# EAGLE schematic Base Station v3b (EAGLE 9.4.2)

## Sheet 1 of 4
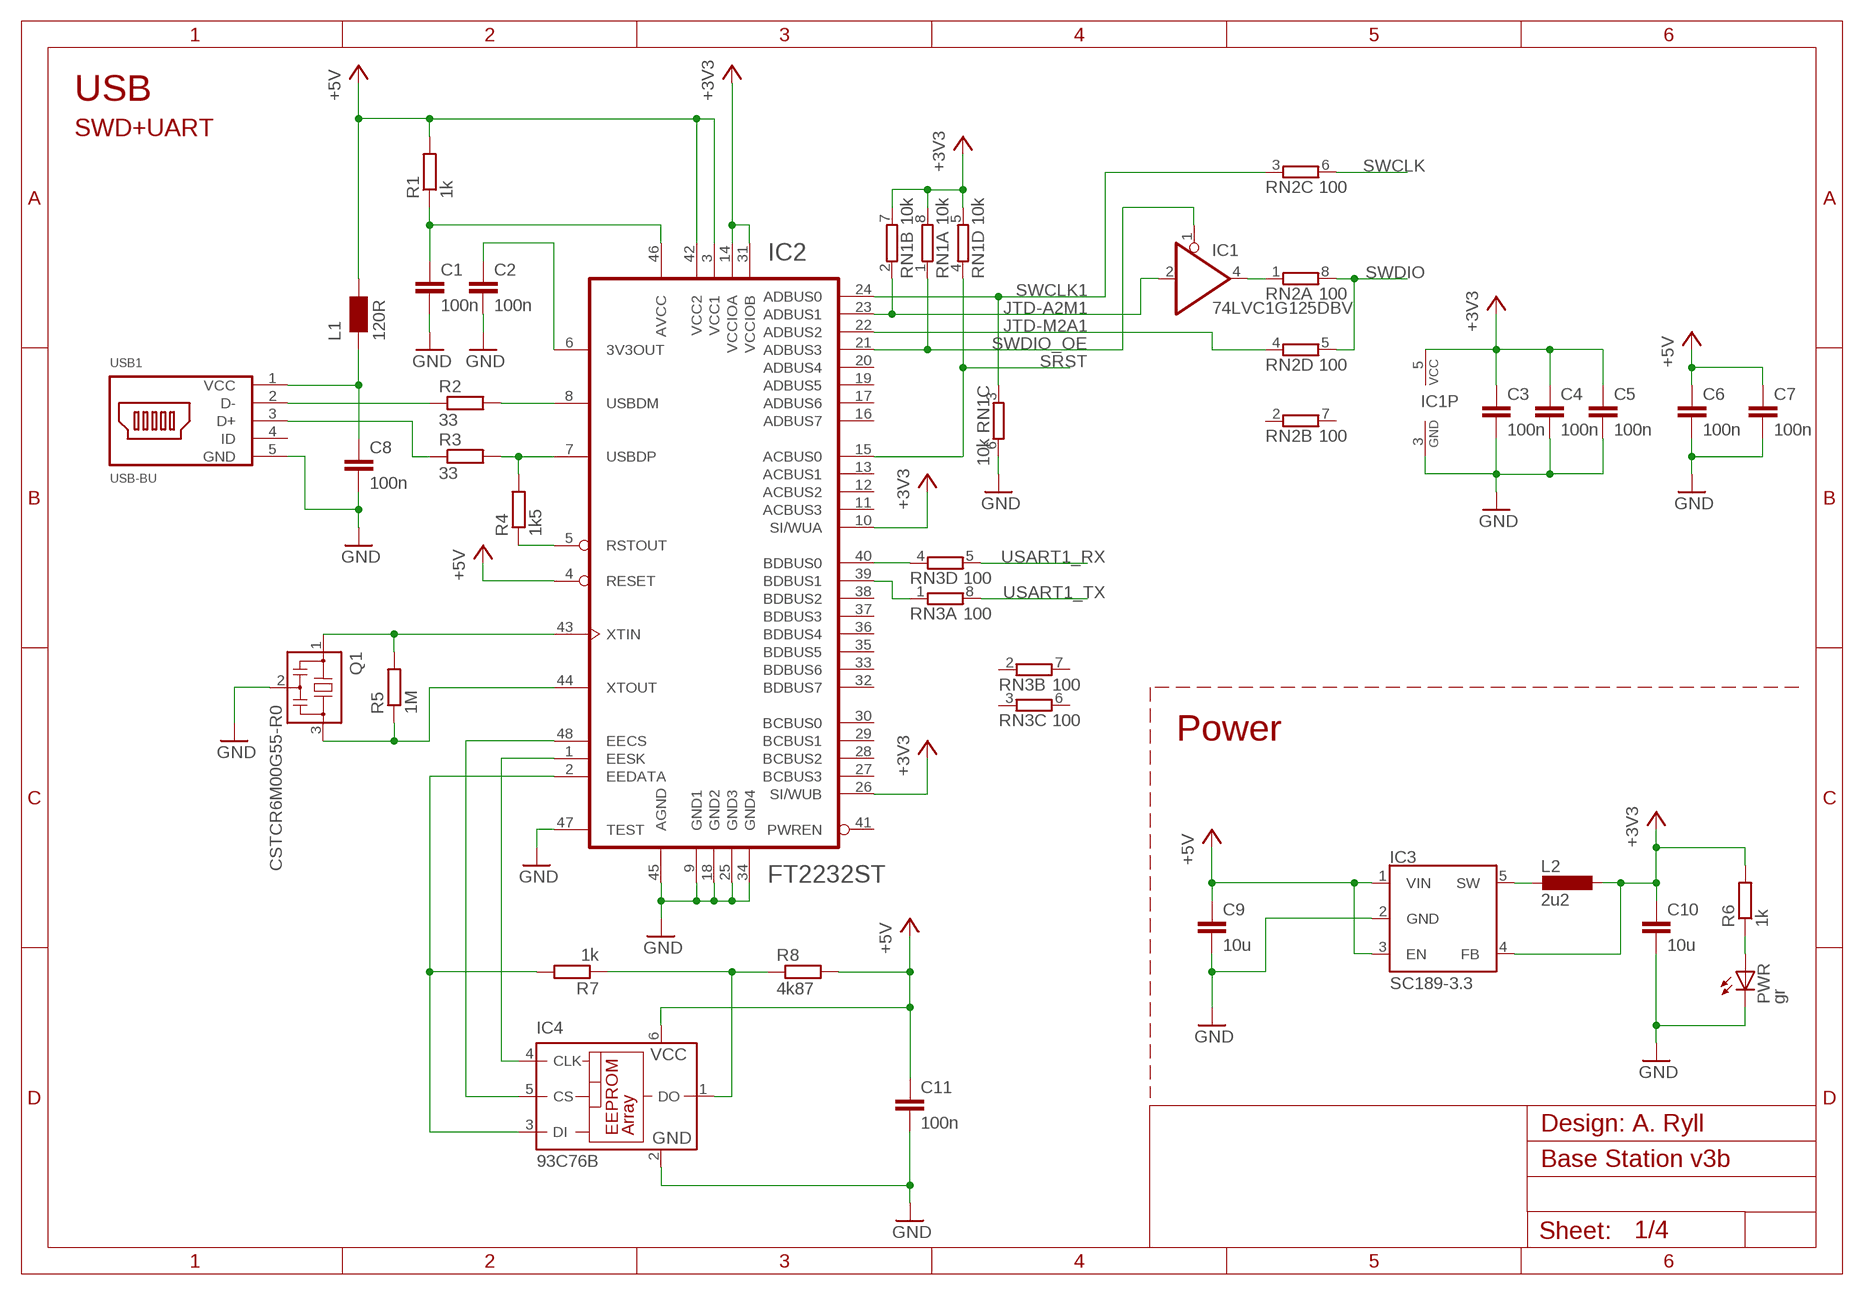
[diagram p0: schematic, sheet 1]

### Parts
C1  100n  C-EUC0603  [C0603]
C2  100n  C-EUC0603  [C0603]
C3  100n  C-EUC0603  [C0603]
C4  100n  C-EUC0603  [C0603]
C5  100n  C-EUC0603  [C0603]
C6  100n  C-EUC0603  [C0603]
C7  100n  C-EUC0603  [C0603]
C8  100n  C-EUC0603  [C0603]
C9  10u  C-EUC0603  [C0603]
C10  10u  C-EUC0603  [C0603]
C11  100n  C-EUC0603  [C0603]
IC1  74LVC1G125DBV  [SOT23-5]
IC2  FT2232ST  [LQFP48-ST]
IC3  SC189-3.3  LM3671  [SOT23-5]
IC4  93C76B  [SOT23-6]
L1  120R  WE-CBF_0603  [0603]
L2  2u2  LIHLP  [IHLP1616]
PWR  gr  LEDCHIP-LED0603  [CHIP-LED0603]
Q1  CSTCR6M00G55-R0  CSTCR6M00G53Z  [CSTCR6M]
R1  1k  R-EU_R0603  [R0603]
R2  33  R-EU_R0603  [R0603]
R3  33  R-EU_R0603  [R0603]
R4  1k5  R-EU_R0603  [R0603]
R5  1M  R-EU_R0603  [R0603]
R6  1k  R-EU_R0603  [R0603]
R7  1k  R-EU_R0603  [R0603]
R8  4k87  R-EU_R0603  [R0603]
RN1  10k  4R-NEXB28V  [EXB28V]
RN2  100  4R-NEXB28V  [EXB28V]
RN3  100  4R-NEXB28V  [EXB28V]
USB1  USB-BU  [USB-BMICRO]

### Nets
+3V3: C3.1 C4.1 C5.1 C10.1 IC1.5(VCC) IC2.10(SI/WUA) IC2.14(VCCIOA) IC2.26(SI/WUB) IC2.31(VCCIOB) IC3.4(FB) L2.P$1 R6.2 RN1.5 RN1.7 RN1.8 ; also sheet 2,3
+5V: C6.1 C7.1 C9.1 C11.1 IC2.3(VCC1) IC2.4(RESET) IC2.42(VCC2) IC3.1(VIN) IC3.3(EN) IC4.6(VCC) L1.2 R1.2 R8.2 ; also sheet 4
GND: C1.2 C2.2 C3.2 C4.2 C5.2 C6.2 C7.2 C8.2 C9.2 C10.2 C11.2 IC1.3(GND) IC2.9(GND1) IC2.18(GND2) IC2.25(GND3) IC2.34(GND4) IC2.45(AGND) IC2.47(TEST) IC3.2(GND) IC4.2(GND) PWR.C Q1.2 RN1.6 USB1.5(GND) ; also sheet 2,3,4
JTD-A2M1: IC1.2(I) IC2.23(ADBUS1) RN1.2
JTD-M2A1: IC2.22(ADBUS2) RN2.4
N$9: IC2.48(EECS) IC4.5(CS)
N$10: IC2.1(EESK) IC4.4(CLK)
N$14: IC2.2(EEDATA) IC4.3(DI) R7.2
N$28: IC2.44(XTOUT) Q1.3 R5.1
N$29: IC4.1(DO) R7.1 R8.1
N$48: PWR.A R6.1
N$56: IC1.4(O) RN2.1
N$71: IC2.40(BDBUS0) RN3.4
N$72: IC2.39(BDBUS1) RN3.1
N$103: IC2.7(USBDP) R3.2 R4.2
N$104: IC2.8(USBDM) R2.2
N$105: IC2.5(RSTOUT) R4.1
N$106: C2.1 IC2.6(3V3OUT)
N$108: C8.1 L1.1 USB1.1(VCC)
N$109: R2.1 USB1.2(D-)
N$110: R3.1 USB1.3(D+)
N$111: C1.1 IC2.46(AVCC) R1.1
N$112: IC2.43(XTIN) Q1.1 R5.2
SRST: IC2.15(ACBUS0) RN1.4 ; also sheet 2
SW-OUT: IC3.5(SW) L2.P$2
SWCLK: RN2.6 ; also sheet 2
SWCLK1: IC2.24(ADBUS0) RN1.3 RN2.3
SWDIO: RN2.5 RN2.8 ; also sheet 2
SWDIO_OE: IC1.1(OE) IC2.21(ADBUS3) RN1.1
USART1_RX: RN3.5 ; also sheet 2
USART1_TX: RN3.8 ; also sheet 2
Unconnected: IC2.11(ACBUS3) IC2.12(ACBUS2) IC2.13(ACBUS1) IC2.16(ADBUS7) IC2.17(ADBUS6) IC2.19(ADBUS5) IC2.20(ADBUS4) IC2.27(BCBUS3) IC2.28(BCBUS2) IC2.29(BCBUS1) IC2.30(BCBUS0) IC2.32(BDBUS7) IC2.33(BDBUS6) IC2.35(BDBUS5) IC2.36(BDBUS4) IC2.37(BDBUS3) IC2.38(BDBUS2) IC2.41(PWREN) RN2.2 RN2.7 RN3.2 RN3.3 RN3.6 RN3.7 USB1.4(ID)

### Notes on the sheet
- USB
- SWD+UART
- Power
- Design: A. Ryll

## Sheet 2 of 4
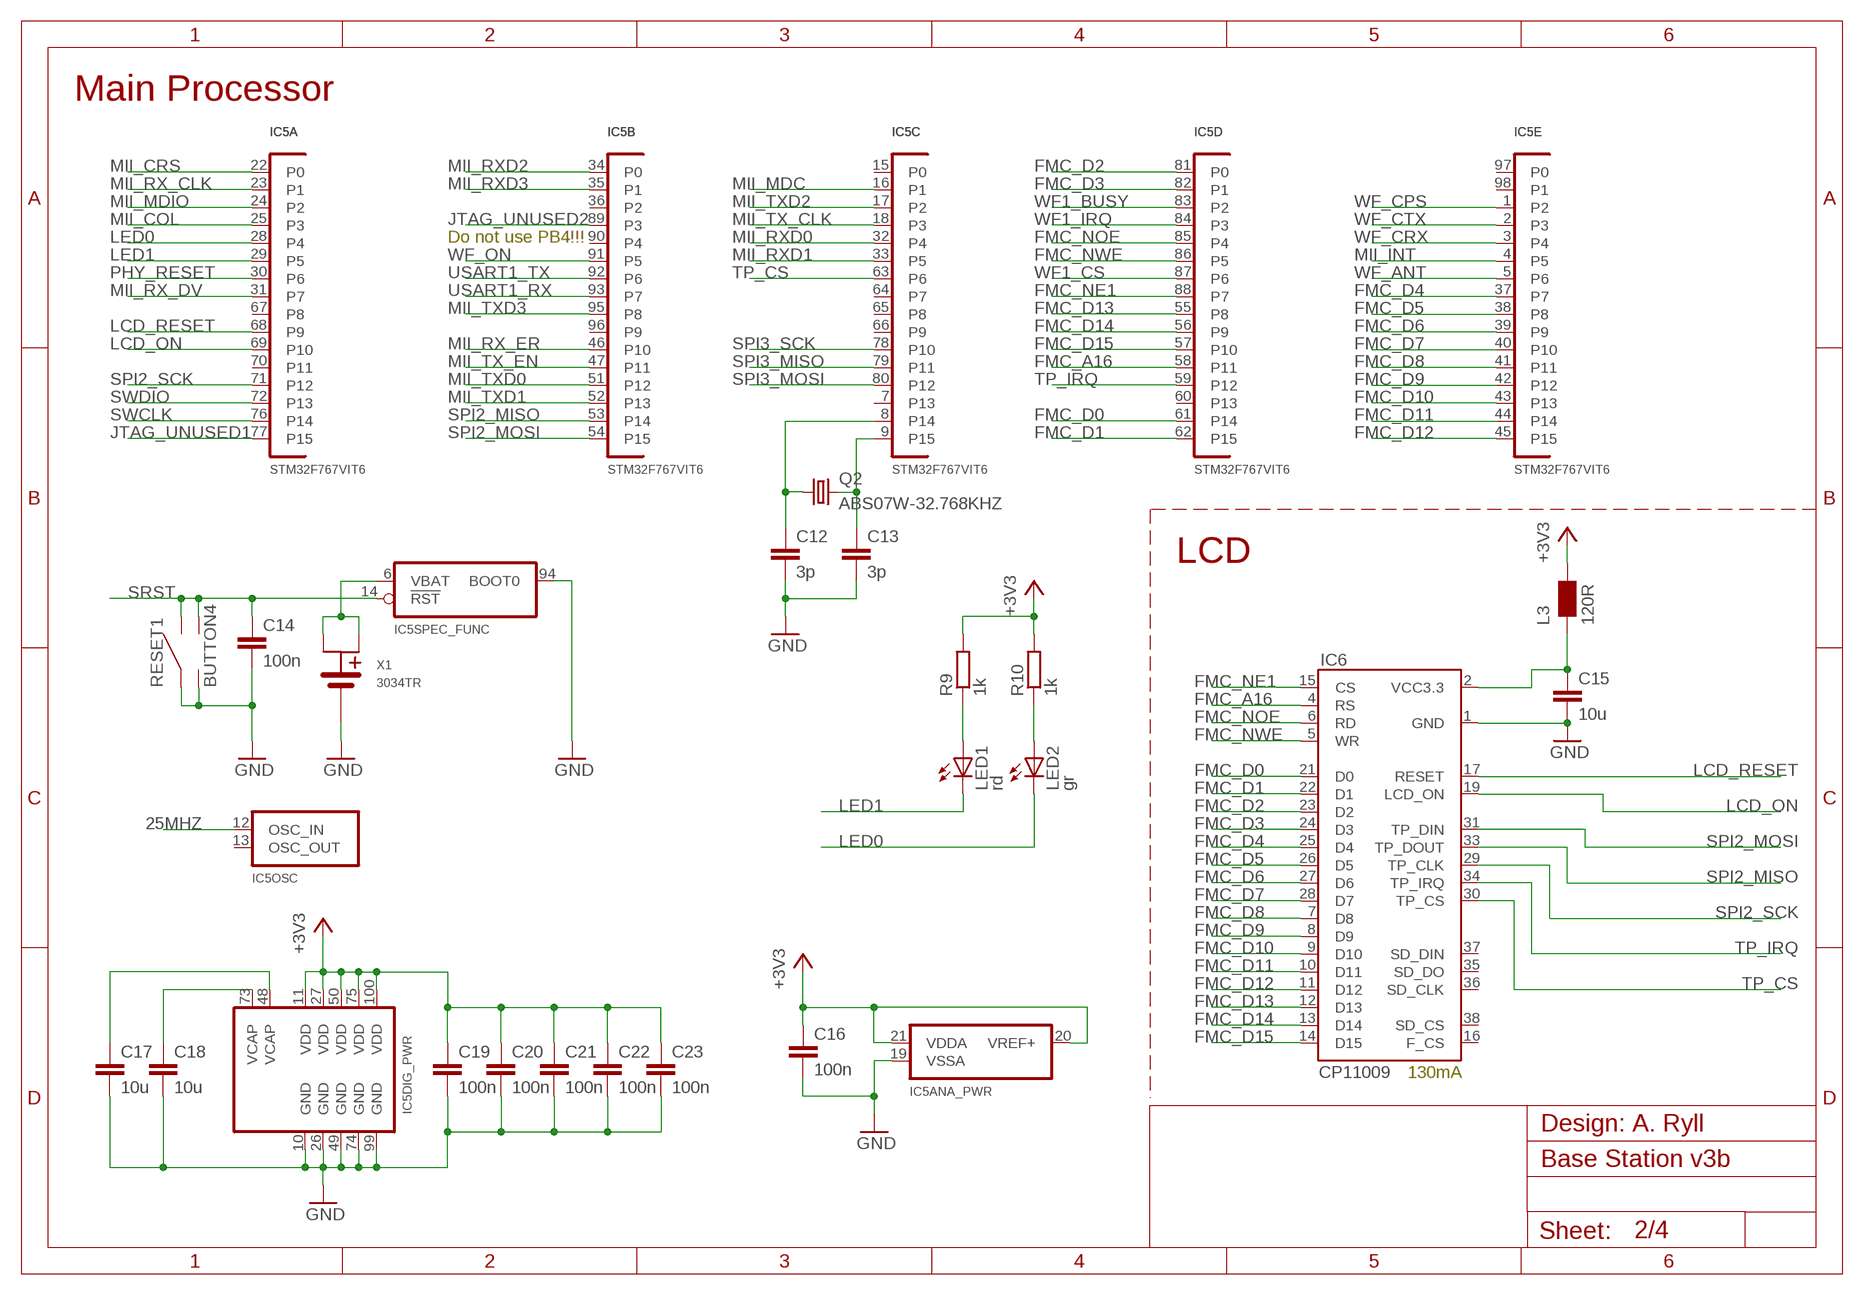
[diagram p1: schematic, sheet 2]

### Parts
C12  3p  C-EUC0603  [C0603]
C13  3p  C-EUC0603  [C0603]
C14  100n  C-EUC0603  [C0603]
C15  10u  C-EUC0603  [C0603]
C16  100n  C-EUC0603  [C0603]
C17  10u  C-EUC0603  [C0603]
C18  10u  C-EUC0603  [C0603]
C19  100n  C-EUC0603  [C0603]
C20  100n  C-EUC0603  [C0603]
C21  100n  C-EUC0603  [C0603]
C22  100n  C-EUC0603  [C0603]
C23  100n  C-EUC0603  [C0603]
IC5  STM32F767VIT6  STM32F76_V  [LQFP100-ST]
IC6  CP11009  CP11009X  [CP11009-THX]
L3  120R  WE-CBF_0603  [0603]
LED1  rd  LEDCHIP-LED0603  [CHIP-LED0603]
LED2  gr  LEDCHIP-LED0603  [CHIP-LED0603]
Q2  ABS07W-32.768KHZ  CRYSTAL07W  [CRYSTAL-07W]
R9  1k  R-EU_R0603  [R0603]
R10  1k  R-EU_R0603  [R0603]
RESET1  BUTTON4  [BUTTON4]
X1  3034TR  BAT3  [CR2025]

### Nets
25MHZ: IC5.12(OSC:OSC_IN) ; also sheet 3
+3V3: C16.1 C19.1 C20.1 C21.1 C22.1 C23.1 IC5.11(DIG_PWR:VDD) IC5.20(ANA_PWR:VREF+) IC5.21(ANA_PWR:VDDA) IC5.27(DIG_PWR:VDD) IC5.50(DIG_PWR:VDD) IC5.75(DIG_PWR:VDD) IC5.100(DIG_PWR:VDD) L3.2 R9.2 R10.2 ; also sheet 1,3
FMC_A16: IC5.58(D:P11) IC6.4(RS)
FMC_D0: IC5.61(D:P14) IC6.21(D0)
FMC_D1: IC5.62(D:P15) IC6.22(D1)
FMC_D2: IC5.81(D:P0) IC6.23(D2)
FMC_D3: IC5.82(D:P1) IC6.24(D3)
FMC_D4: IC5.37(E:P7) IC6.25(D4)
FMC_D5: IC5.38(E:P8) IC6.26(D5)
FMC_D6: IC5.39(E:P9) IC6.27(D6)
FMC_D7: IC5.40(E:P10) IC6.28(D7)
FMC_D8: IC5.41(E:P11) IC6.7(D8)
FMC_D9: IC5.42(E:P12) IC6.8(D9)
FMC_D10: IC5.43(E:P13) IC6.9(D10)
FMC_D11: IC5.44(E:P14) IC6.10(D11)
FMC_D12: IC5.45(E:P15) IC6.11(D12)
FMC_D13: IC5.55(D:P8) IC6.12(D13)
FMC_D14: IC5.56(D:P9) IC6.13(D14)
FMC_D15: IC5.57(D:P10) IC6.14(D15)
FMC_NE1: IC5.88(D:P7) IC6.15(CS)
FMC_NOE: IC5.85(D:P4) IC6.6(RD)
FMC_NWE: IC5.86(D:P5) IC6.5(WR)
GND: C12.2 C13.2 C14.2 C15.2 C16.2 C17.2 C18.2 C19.2 C20.2 C21.2 C22.2 C23.2 IC5.10(DIG_PWR:GND) IC5.19(ANA_PWR:VSSA) IC5.26(DIG_PWR:GND) IC5.49(DIG_PWR:GND) IC5.74(DIG_PWR:GND) IC5.94(SPEC_FUNC:BOOT0) IC5.99(DIG_PWR:GND) IC6.1(GND) RESET1.1 RESET1.2 X1.GND ; also sheet 1,3,4
JTAG_UNUSED1: IC5.77(A:P15)
JTAG_UNUSED2: IC5.89(B:P3)
LCD_ON: IC5.69(A:P10) IC6.19(LCD_ON)
LCD_RESET: IC5.68(A:P9) IC6.17(RESET)
LED0: IC5.28(A:P4) LED2.C
LED1: IC5.29(A:P5) LED1.C
MII_COL: IC5.25(A:P3) ; also sheet 3
MII_CRS: IC5.22(A:P0) ; also sheet 3
MII_INT: IC5.4(E:P5) ; also sheet 3
MII_MDC: IC5.16(C:P1) ; also sheet 3
MII_MDIO: IC5.24(A:P2) ; also sheet 3
MII_RX_CLK: IC5.23(A:P1) ; also sheet 3
MII_RX_DV: IC5.31(A:P7) ; also sheet 3
MII_RX_ER: IC5.46(B:P10) ; also sheet 3
MII_RXD0: IC5.32(C:P4) ; also sheet 3
MII_RXD1: IC5.33(C:P5) ; also sheet 3
MII_RXD2: IC5.34(B:P0) ; also sheet 3
MII_RXD3: IC5.35(B:P1) ; also sheet 3
MII_TX_CLK: IC5.18(C:P3) ; also sheet 3
MII_TX_EN: IC5.47(B:P11) ; also sheet 3
MII_TXD0: IC5.51(B:P12) ; also sheet 3
MII_TXD1: IC5.52(B:P13) ; also sheet 3
MII_TXD2: IC5.17(C:P2) ; also sheet 3
MII_TXD3: IC5.95(B:P8) ; also sheet 3
N$6: C18.1 IC5.73(DIG_PWR:VCAP)
N$31: C17.1 IC5.48(DIG_PWR:VCAP)
N$67: LED2.A R10.1
N$68: LED1.A R9.1
N$73: C15.1 IC6.2(VCC3.3) L3.1
OSC32_IN: C12.1 IC5.8(C:P14) Q2.1
OSC32_OUT: C13.1 IC5.9(C:P15) Q2.2
PHY_RESET: IC5.30(A:P6) ; also sheet 3
SPI2_MISO: IC5.53(B:P14) IC6.33(TP_DOUT)
SPI2_MOSI: IC5.54(B:P15) IC6.31(TP_DIN)
SPI2_SCK: IC5.71(A:P12) IC6.29(TP_CLK)
SPI3_MISO: IC5.79(C:P11) ; also sheet 4
SPI3_MOSI: IC5.80(C:P12) ; also sheet 4
SPI3_SCK: IC5.78(C:P10) ; also sheet 4
SRST: C14.1 IC5.14(SPEC_FUNC:!RST) RESET1.3 RESET1.4 ; also sheet 1
SWCLK: IC5.76(A:P14) ; also sheet 1
SWDIO: IC5.72(A:P13) ; also sheet 1
TP_CS: IC5.63(C:P6) IC6.30(TP_CS)
TP_IRQ: IC5.59(D:P12) IC6.34(TP_IRQ)
USART1_RX: IC5.93(B:P7) ; also sheet 1
USART1_TX: IC5.92(B:P6) ; also sheet 1
VBAT: IC5.6(SPEC_FUNC:VBAT) X1.POS1 X1.POS2
WF1_BUSY: IC5.83(D:P2) ; also sheet 4
WF1_CS: IC5.87(D:P6) ; also sheet 4
WF1_IRQ: IC5.84(D:P3) ; also sheet 4
WF_ANT: IC5.5(E:P6) ; also sheet 4
WF_CPS: IC5.1(E:P2) ; also sheet 4
WF_CRX: IC5.3(E:P4) ; also sheet 4
WF_CTX: IC5.2(E:P3) ; also sheet 4
WF_ON: IC5.91(B:P5) ; also sheet 4
Unconnected: IC5.7(C:P13) IC5.13(OSC:OSC_OUT) IC5.15(C:P0) IC5.36(B:P2) IC5.60(D:P13) IC5.64(C:P7) IC5.65(C:P8) IC5.66(C:P9) IC5.67(A:P8) IC5.70(A:P11) IC5.90(B:P4) IC5.96(B:P9) IC5.97(E:P0) IC5.98(E:P1) IC6.16(F_CS) IC6.35(SD_DO) IC6.36(SD_CLK) IC6.37(SD_DIN) IC6.38(SD_CS)

### Notes on the sheet
- Main Processor
- Do not use PB4!!!
- LCD
- 130mA
- Design: A. Ryll

## Sheet 3 of 4
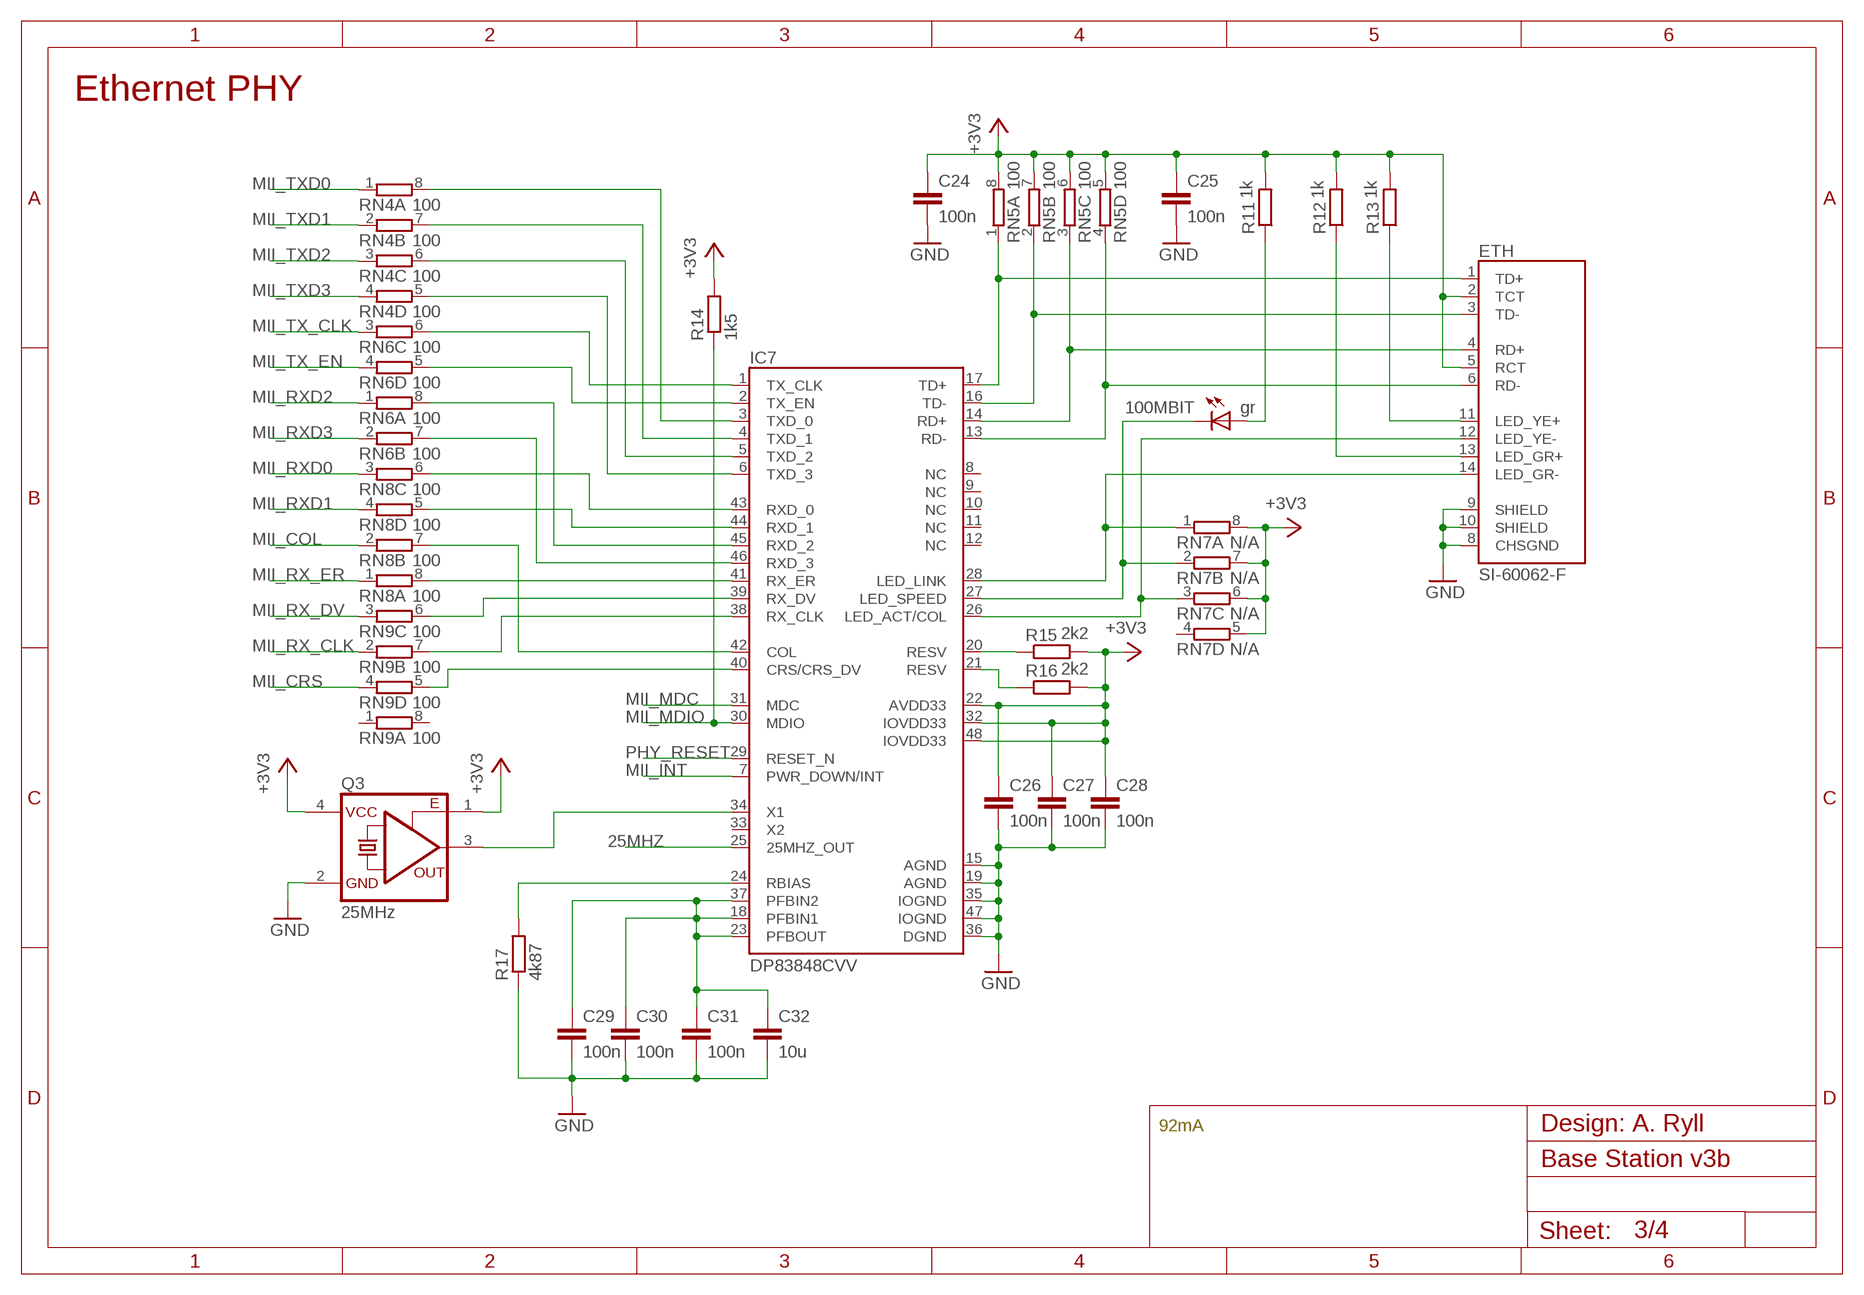
[diagram p2: schematic, sheet 3]

### Parts
100MBIT  gr  LEDCHIP-LED0603  [CHIP-LED0603]
C24  100n  C-EUC0603  [C0603]
C25  100n  C-EUC0603  [C0603]
C26  100n  C-EUC0603  [C0603]
C27  100n  C-EUC0603  [C0603]
C28  100n  C-EUC0603  [C0603]
C29  100n  C-EUC0603  [C0603]
C30  100n  C-EUC0603  [C0603]
C31  100n  C-EUC0603  [C0603]
C32  10u  C-EUC0603  [C0603]
ETH  SI-60062-F  RJ45-LED  [RJ45-LED]
IC7  DP83848CVV  DB8348C  [LQFP48]
Q3  25MHz  OSCI7X  [7X]
R11  1k  R-EU_R0603  [R0603]
R12  1k  R-EU_R0603  [R0603]
R13  1k  R-EU_R0603  [R0603]
R14  1k5  R-EU_R0603  [R0603]
R15  2k2  R-EU_R0603  [R0603]
R16  2k2  R-EU_R0603  [R0603]
R17  4k87  R-EU_R0603  [R0603]
RN4  100  4R-NEXB28V  [EXB28V]
RN5  100  4R-NEXB28V  [EXB28V]
RN6  100  4R-NEXB28V  [EXB28V]
RN7  N/A  4R-NEXB28V  [EXB28V]
RN8  100  4R-NEXB28V  [EXB28V]
RN9  100  4R-NEXB28V  [EXB28V]

### Nets
25MHZ: IC7.25(25MHZ_OUT) ; also sheet 2
+3V3: C24.1 C25.1 C26.1 C27.1 C28.1 ETH.2(TCT) ETH.5(RCT) IC7.22(AVDD33) IC7.32(IOVDD33) IC7.48(IOVDD33) Q3.1(OE) Q3.4(VCC) R11.2 R12.2 R13.2 R14.2 R15.2 R16.2 RN5.5 RN5.6 RN5.7 RN5.8 RN7.5 RN7.6 RN7.7 RN7.8 ; also sheet 1,2
GND: C24.2 C25.2 C26.2 C27.2 C28.2 C29.2 C30.2 C31.2 C32.2 ETH.8(CHSGND) ETH.9(SHIELD) ETH.10(SHIELD) IC7.15(AGND) IC7.19(AGND) IC7.35(IOGND) IC7.36(DGND) IC7.47(IOGND) Q3.2(GND) R17.1 ; also sheet 1,2,4
MII_COL: RN8.2 ; also sheet 2
MII_CRS: RN9.4 ; also sheet 2
MII_INT: IC7.7(PWR_DOWN/INT) ; also sheet 2
MII_MDC: IC7.31(MDC) ; also sheet 2
MII_MDIO: IC7.30(MDIO) R14.1 ; also sheet 2
MII_RX_CLK: RN9.2 ; also sheet 2
MII_RX_DV: RN9.3 ; also sheet 2
MII_RX_ER: RN8.1 ; also sheet 2
MII_RXD0: RN8.3 ; also sheet 2
MII_RXD1: RN8.4 ; also sheet 2
MII_RXD2: RN6.1 ; also sheet 2
MII_RXD3: RN6.2 ; also sheet 2
MII_TX_CLK: RN6.3 ; also sheet 2
MII_TX_EN: RN6.4 ; also sheet 2
MII_TXD0: RN4.1 ; also sheet 2
MII_TXD1: RN4.2 ; also sheet 2
MII_TXD2: RN4.3 ; also sheet 2
MII_TXD3: RN4.4 ; also sheet 2
N$11: IC7.3(TXD_0) RN4.8
N$12: IC7.4(TXD_1) RN4.7
N$13: IC7.5(TXD_2) RN4.6
N$15: IC7.6(TXD_3) RN4.5
N$16: IC7.1(TX_CLK) RN6.6
N$17: IC7.2(TX_EN) RN6.5
N$18: IC7.45(RXD_2) RN6.8
N$30: IC7.46(RXD_3) RN6.7
N$32: IC7.43(RXD_0) RN8.6
N$33: IC7.44(RXD_1) RN8.5
N$34: IC7.42(COL) RN8.7
N$35: IC7.41(RX_ER) RN8.8
N$36: IC7.39(RX_DV) RN9.6
N$37: IC7.38(RX_CLK) RN9.7
N$38: IC7.40(CRS/CRS_DV) RN9.5
N$39: IC7.24(RBIAS) R17.2
N$40: C29.1 C30.1 C31.1 C32.1 IC7.18(PFBIN1) IC7.23(PFBOUT) IC7.37(PFBIN2)
N$41: IC7.20(RESV) R15.1
N$42: IC7.21(RESV) R16.1
N$43: ETH.12(LED_YE-) IC7.26(LED_ACT/COL) RN7.3
N$44: 100MBIT.C IC7.27(LED_SPEED) RN7.2
N$46: ETH.14(LED_GR-) IC7.28(LED_LINK) RN7.1
N$47: ETH.6(RD-) IC7.13(RD-) RN5.4
N$49: ETH.4(RD+) IC7.14(RD+) RN5.3
N$50: ETH.3(TD-) IC7.16(TD-) RN5.2
N$51: ETH.1(TD+) IC7.17(TD+) RN5.1
N$52: 100MBIT.A R11.1
N$53: ETH.13(LED_GR+) R12.1
N$54: ETH.11(LED_YE+) R13.1
N$55: IC7.34(X1) Q3.3(FO)
PHY_RESET: IC7.29(RESET_N) ; also sheet 2
Unconnected: IC7.8(NC) IC7.9(NC) IC7.10(NC) IC7.11(NC) IC7.12(NC) IC7.33(X2) RN7.4 RN9.1 RN9.8

### Notes on the sheet
- Ethernet PHY
- 92mA | Design: A. Ryll

## Sheet 4 of 4
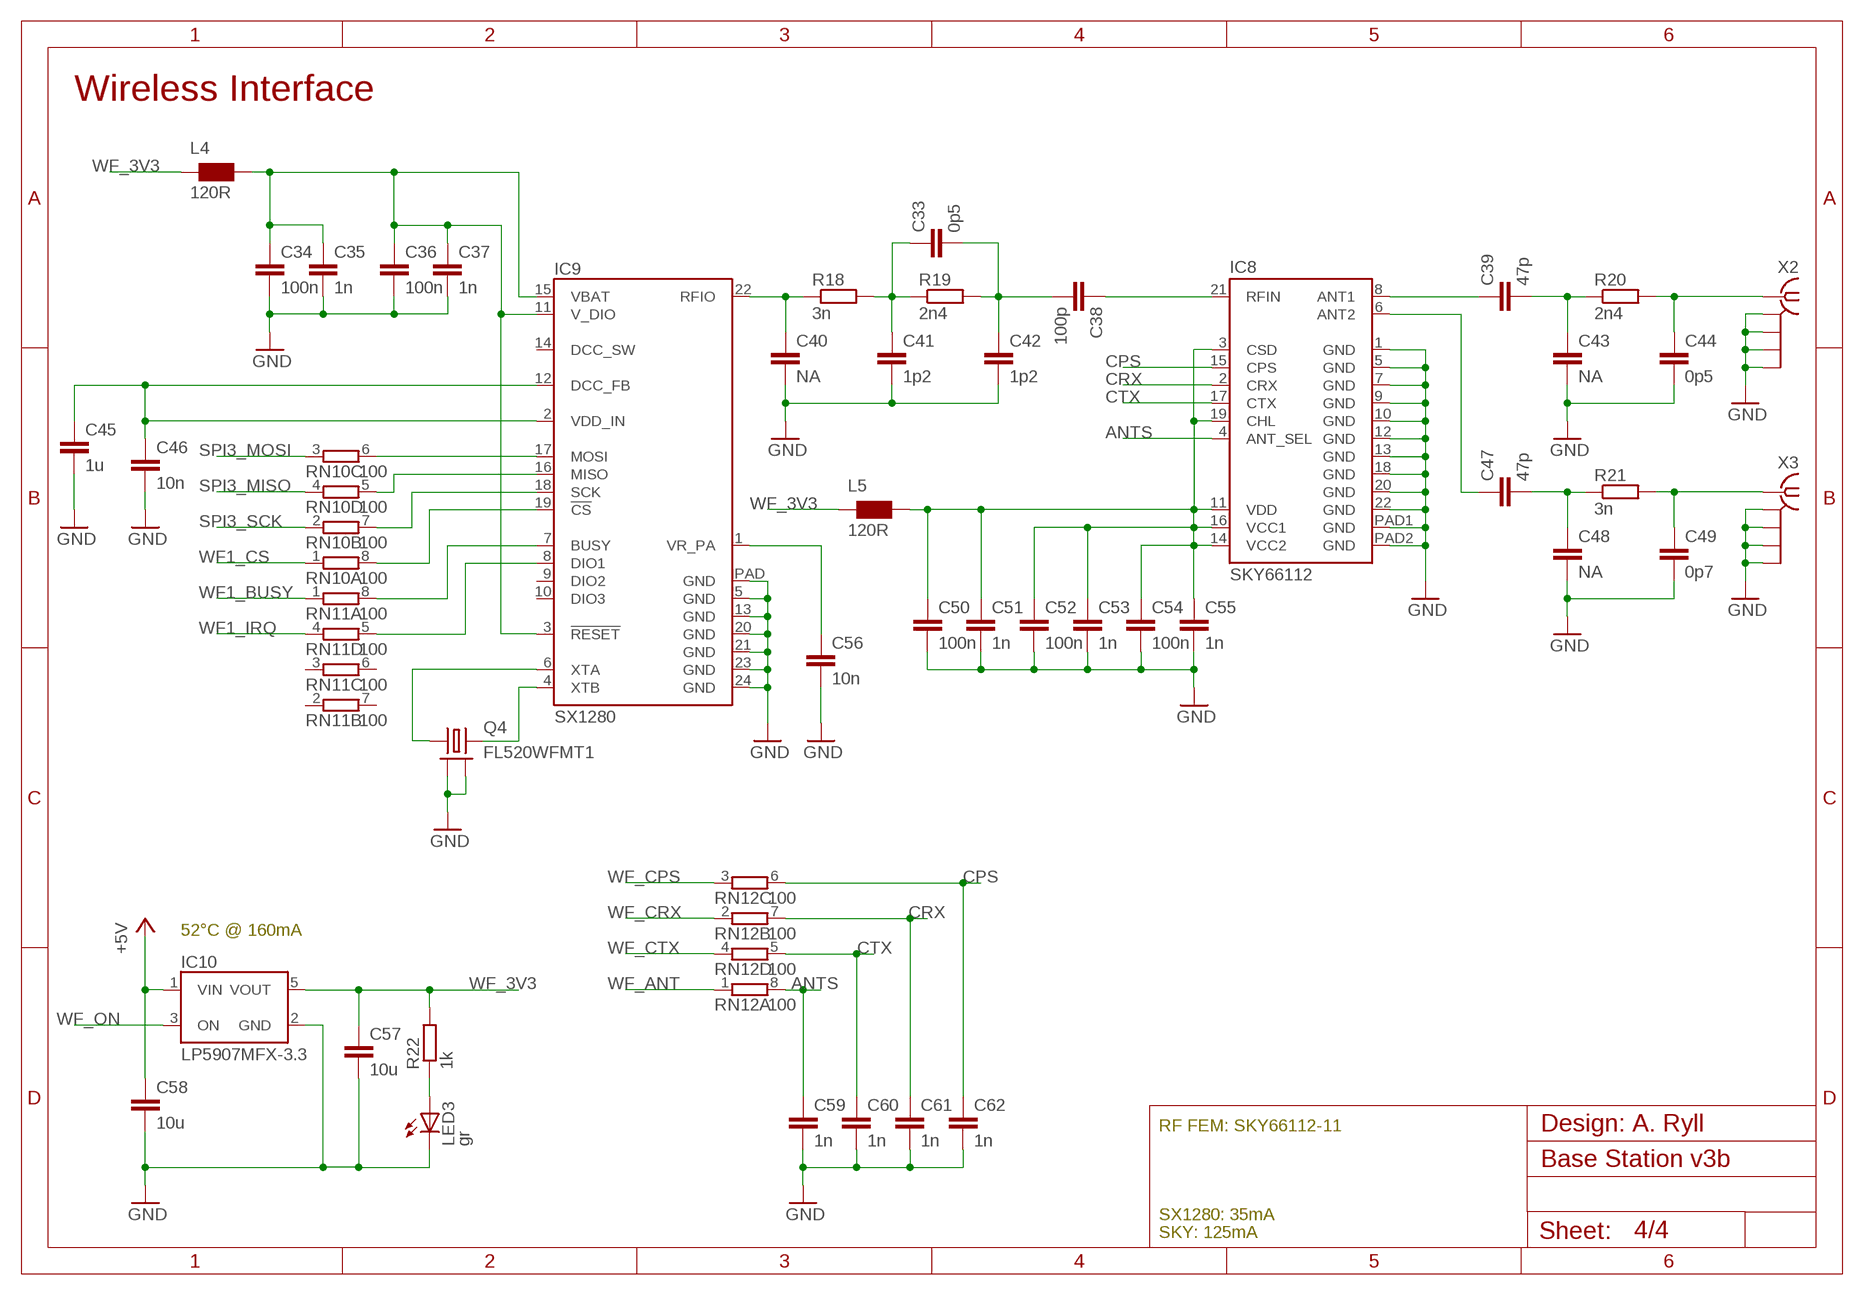
[diagram p3: schematic, sheet 4]

### Parts
C33  0p5  C-EUC0402  [C0402]
C34  100n  C-EUC0603  [C0603]
C35  1n  C-EUC0603  [C0603]
C36  100n  C-EUC0603  [C0603]
C37  1n  C-EUC0603  [C0603]
C38  100p  C-EUC0402  [C0402]
C39  47p  C-EUC0402  [C0402]
C40  NA  C-EUC0402  [C0402]
C41  1p2  C-EUC0402  [C0402]
C42  1p2  C-EUC0402  [C0402]
C43  NA  C-EUC0402  [C0402]
C44  0p5  C-EUC0402  [C0402]
C45  1u  C-EUC0603  [C0603]
C46  10n  C-EUC0603  [C0603]
C47  47p  C-EUC0402  [C0402]
C48  NA  C-EUC0402  [C0402]
C49  0p7  C-EUC0402  [C0402]
C50  100n  C-EUC0603  [C0603]
C51  1n  C-EUC0603  [C0603]
C52  100n  C-EUC0603  [C0603]
C53  1n  C-EUC0603  [C0603]
C54  100n  C-EUC0603  [C0603]
C55  1n  C-EUC0603  [C0603]
C56  10n  C-EUC0603  [C0603]
C57  10u  C-EUC0603  [C0603]
C58  10u  C-EUC0603  [C0603]
C59  1n  C-EUC0603  [C0603]
C60  1n  C-EUC0603  [C0603]
C61  1n  C-EUC0603  [C0603]
C62  1n  C-EUC0603  [C0603]
IC8  SKY66112  [SMCM-22]
IC9  SX1280  [QFN24L]
IC10  LP5907MFX-3.3  LP2980  [SOT23-5L]
L4  120R  WE-CBF_0603  [0603]
L5  120R  WE-CBF_0603  [0603]
LED3  gr  LEDCHIP-LED0603  [CHIP-LED0603]
Q4  FL520WFMT1  CRYSTAL47M  [CRYSTAL-7M]
R18  3n  R-EU_R0402  [R0402]
R19  2n4  R-EU_R0402  [R0402]
R20  2n4  R-EU_R0402  [R0402]
R21  3n  R-EU_R0402  [R0402]
R22  1k  R-EU_R0603  [R0603]
RN10  100  4R-NEXB28V  [EXB28V]
RN11  100  4R-NEXB28V  [EXB28V]
RN12  100  4R-NEXB28V  [EXB28V]
X2  ANT-SMA-EDGERA  [ANT-SMA-RA]
X3  ANT-SMA-EDGERA  [ANT-SMA-RA]

### Nets
+5V: C58.1 IC10.1(VIN) ; also sheet 1
ANTS: C59.1 IC8.4(ANT_SEL) RN12.8
CPS: C62.1 IC8.15(CPS) RN12.6
CRX: C61.1 IC8.2(CRX) RN12.7
CTX: C60.1 IC8.17(CTX) RN12.5
GND: C34.2 C35.2 C36.2 C37.2 C40.2 C41.2 C42.2 C43.2 C44.2 C45.2 C46.2 C48.2 C49.2 C50.2 C51.2 C52.2 C53.2 C54.2 C55.2 C56.2 C57.2 C58.2 C59.2 C60.2 C61.2 C62.2 IC8.1(GND) IC8.5(GND) IC8.7(GND) IC8.9(GND) IC8.10(GND) IC8.12(GND) IC8.13(GND) IC8.18(GND) IC8.20(GND) IC8.22(GND) IC8.PAD1(GND) IC8.PAD2(GND) IC9.5(GND) IC9.13(GND) IC9.20(GND) IC9.21(GND) IC9.23(GND) IC9.24(GND) IC9.PAD(GND) IC10.2(GND) LED3.C Q4.2(GND1) Q4.4(GND2) X2.GND1(GND) X2.GND2(GND1) X2.GND3(GND2) X2.GND4(GND3) X3.GND1(GND) X3.GND2(GND1) X3.GND3(GND2) X3.GND4(GND3) ; also sheet 1,2,3
N$1: IC9.17(MOSI) RN10.6
N$2: IC9.16(MISO) RN10.5
N$3: IC9.18(SCK) RN10.7
N$4: IC9.19(!CS) RN10.8
N$5: IC9.7(BUSY) RN11.8
N$7: IC9.8(DIO1) RN11.5
N$20: LED3.A R22.1
N$74: IC9.6(XTA) Q4.1
N$75: IC9.4(XTB) Q4.3
N$76: C33.1 C41.1 R18.2 R19.1
N$77: C33.2 C38.2 C42.1 R19.2
N$78: C56.1 IC9.1(VR_PA)
N$79: C45.1 C46.1 IC9.2(VDD_IN) IC9.12(DCC_FB)
N$80: C38.1 IC8.21(RFIN)
N$82 [50Ohm]: C39.2 C43.1 R20.1
N$83 [50Ohm]: C44.1 R20.2 X2.C
N$84 [50Ohm]: C47.2 C48.1 R21.1
N$85 [50Ohm]: C49.1 R21.2 X3.C
N$86 [50Ohm]: C39.1 IC8.8(ANT1)
N$87 [50Ohm]: C47.1 IC8.6(ANT2)
RFIO1: C40.1 IC9.22(RFIO) R18.1
SPI3_MISO: RN10.4 ; also sheet 2
SPI3_MOSI: RN10.3 ; also sheet 2
SPI3_SCK: RN10.2 ; also sheet 2
WF1_BUSY: RN11.1 ; also sheet 2
WF1_CS: RN10.1 ; also sheet 2
WF1_IRQ: RN11.4 ; also sheet 2
WF_3V3: C57.1 IC10.5(VOUT) L4.1 L5.1 R22.2
WF_3V3FEM: C50.1 C51.1 C52.1 C53.1 C54.1 C55.1 IC8.3(CSD) IC8.11(VDD) IC8.14(VCC2) IC8.16(VCC1) IC8.19(CHL) L5.2
WF_3V3SX: C34.1 C35.1 C36.1 C37.1 IC9.3(!RESET) IC9.11(V_DIO) IC9.15(VBAT) L4.2
WF_ANT: RN12.1 ; also sheet 2
WF_CPS: RN12.3 ; also sheet 2
WF_CRX: RN12.2 ; also sheet 2
WF_CTX: RN12.4 ; also sheet 2
WF_ON: IC10.3(ON) ; also sheet 2
Unconnected: IC9.9(DIO2) IC9.10(DIO3) IC9.14(DCC_SW) RN11.2 RN11.3 RN11.6 RN11.7

### Notes on the sheet
- Wireless Interface
- 52°C @ 160mA
- RF FEM: SKY66112-11 | Design: A. Ryll
- SX1280: 35mA
- SKY: 125mA

## Library data of the parts
100MBIT LED1-LED3 PWR = led:LED: LED OSRAM: - CHIPLED LG R971, LG N971, LY N971, LG Q971, LY Q971, LO R971, LY R971 LH N974, LH R974 LS Q976, LO Q976, LY Q976 LO Q996 - Hyper CHIPLED LW Q18S LB Q993, LB Q99A, LB R99A - SideLED LS A670, LO A670, LY A670, LG A670, LP A670 LB A673, LV A673, LT A673, LW A673 LH A674 LY A675 LS A676, LA A676, LO A676, LY A676, LW A676 LS A679, LY A679, LG A679 - Hyper Micro SIDELED® LS Y876, LA Y876, LO Y876, LY Y876 LT Y87S - SmartLED LW L88C, LW L88S LB L89C, LB L89S, LG L890 LS L89K, LO L89K, LY L89K LS L896, LA L896, LO L896, LY L896 - TOPLED LS T670, LO T670, LY T670, LG T670, LP T670 LSG T670, LSP T670, LSY T670, LOP T670, LYG T670 LG T671, LOG T671, LSG T671 LB T673, LV T673, LT T673, LW T673 LH T674 LS T676, LA T676, LO T676, LY T676, LB T676, LH T676, LSB T676, LW T676 LB T67C, LV T67C, LT T67C, LS T67K, LO T67K, LY T67K, LW E67C LS E67B, LA E67B, LO E67B, LY E67B, LB E67C, LV E67C, LT E67C LW T67C LS T679, LY T679, LG T679 LS T770, LO T770, LY T770, LG T770, LP T770 LB T773, LV T773, LT T773, LW T773 LH T774 LS E675, LA E675, LY E675, LS T675 LS T776, LA T776, LO T776, LY T776, LB T776 LHGB T686 LT T68C, LB T68C - Hyper Mini TOPLED® LB M676 - Mini TOPLED Santana® LG M470 LS M47K, LO M47K, LY M47K Source: http://www.osram.convergy.de LUXEON: - LUMILED® LXK2-PW12-R00, LXK2-PW12-S00, LXK2-PW14-U00, LXK2-PW14-V00 LXK2-PM12-R00, LXK2-PM12-S00, LXK2-PM14-U00 LXK2-PE12-Q00, LXK2-PE12-R00, LXK2-PE12-S00, LXK2-PE14-T00, LXK2-PE14-U00 LXK2-PB12-K00, LXK2-PB12-L00, LXK2-PB12-M00, LXK2-PB14-N00, LXK2-PB14-P00, LXK2-PB14-Q00 LXK2-PR12-L00, LXK2-PR12-M00, LXK2-PR14-Q00, LXK2-PR14-R00 LXK2-PD12-Q00, LXK2-PD12-R00, LXK2-PD12-S00 LXK2-PH12-R00, LXK2-PH12-S00 LXK2-PL12-P00, LXK2-PL12-Q00, LXK2-PL12-R00 Source: www.luxeon.com KINGBRIGHT: KA-3528ASYC Source: www.kingbright.com
C1-C62 = rcl:C-EU: CAPACITOR, European symbol
ETH = Marvin:RJ45-LED
IC1 = 74xx-little-de:74*1G125: Single Bus Buffer Gate with 3-State Output
IC2 = Marvin:FT2232
IC3 = Marvin:LM3671
IC4 = microchip:93*76?: 8K Microwire Compatible Serial EEPROM Source: http://ww1.microchip.com/downloads/en/DeviceDoc/21796H.pdf; OC_FARNELL: unknown; OC_NEWARK: unknown
IC5 = Marvin:STM32F76_V: STM32F76_V LQFP100
IC6 = Marvin:CP11009
IC7 = Marvin:DB8348C
IC8 = Marvin:SKY66112: SKY66112-11
IC9 = Marvin:SX1280
IC10 = Marvin:LP2980
L1 L3-L5 = wuerth-elektronik:WE-CBF: SMD EMI Suppression Ferrite Beads - excellent anti-EMI properties - low DCR - impedances till 3000 ohms - rated current up to 6 A
L2 = Marvin:L; OC_FARNELL: 1741293
Q1 = Marvin:CSTCR: Resonator Source: murata.co.jp; MPN: CSTCR6M00G53-R0; OC_FARNELL: 1170434; OC_NEWARK: 25M8759
Q2 = Marvin:CRYSTAL
Q3 = Marvin:OSCI
Q4 = Marvin:CRYSTAL4
R1-R22 = rcl:R-EU_: RESISTOR, European symbol
RESET1 = Marvin:BUTTON4: Tyco Push Button FSM2JSMA Farnell Order: 3801287
RN1-RN12 = resistor-dil:4R-N: Array Chip Resistor Source: RS Component / Phycomp; OC_FARNELL: unknown; OC_NEWARK: unknown
USB1 = Marvin:USB-B: USB Connector Micro: Molex 47346-0001
X1 = Marvin:BAT3: Coin Cell Holder CR2020, CR2025, CR2032 36-3034CT-ND
X2 X3 = Marvin:ANT-SMA-EDGE

## Net classes
1 50Ohm: width 0.643 mm, clearance 0.35 mm